# EasyEDA Pro project 4Layer_Artix7_DDR3_Core_Board.epro, schematic Schematic1
Board Name: Board1; Create Date: 2025-05-25; Page Name: P1; Project Name: Artix7_DDR_4Layer_Core; Schematic Name: Schematic1; Update Date: 2025-05-25; Company: 嘉立创EDA; Page Size: A4; Version: V1.0
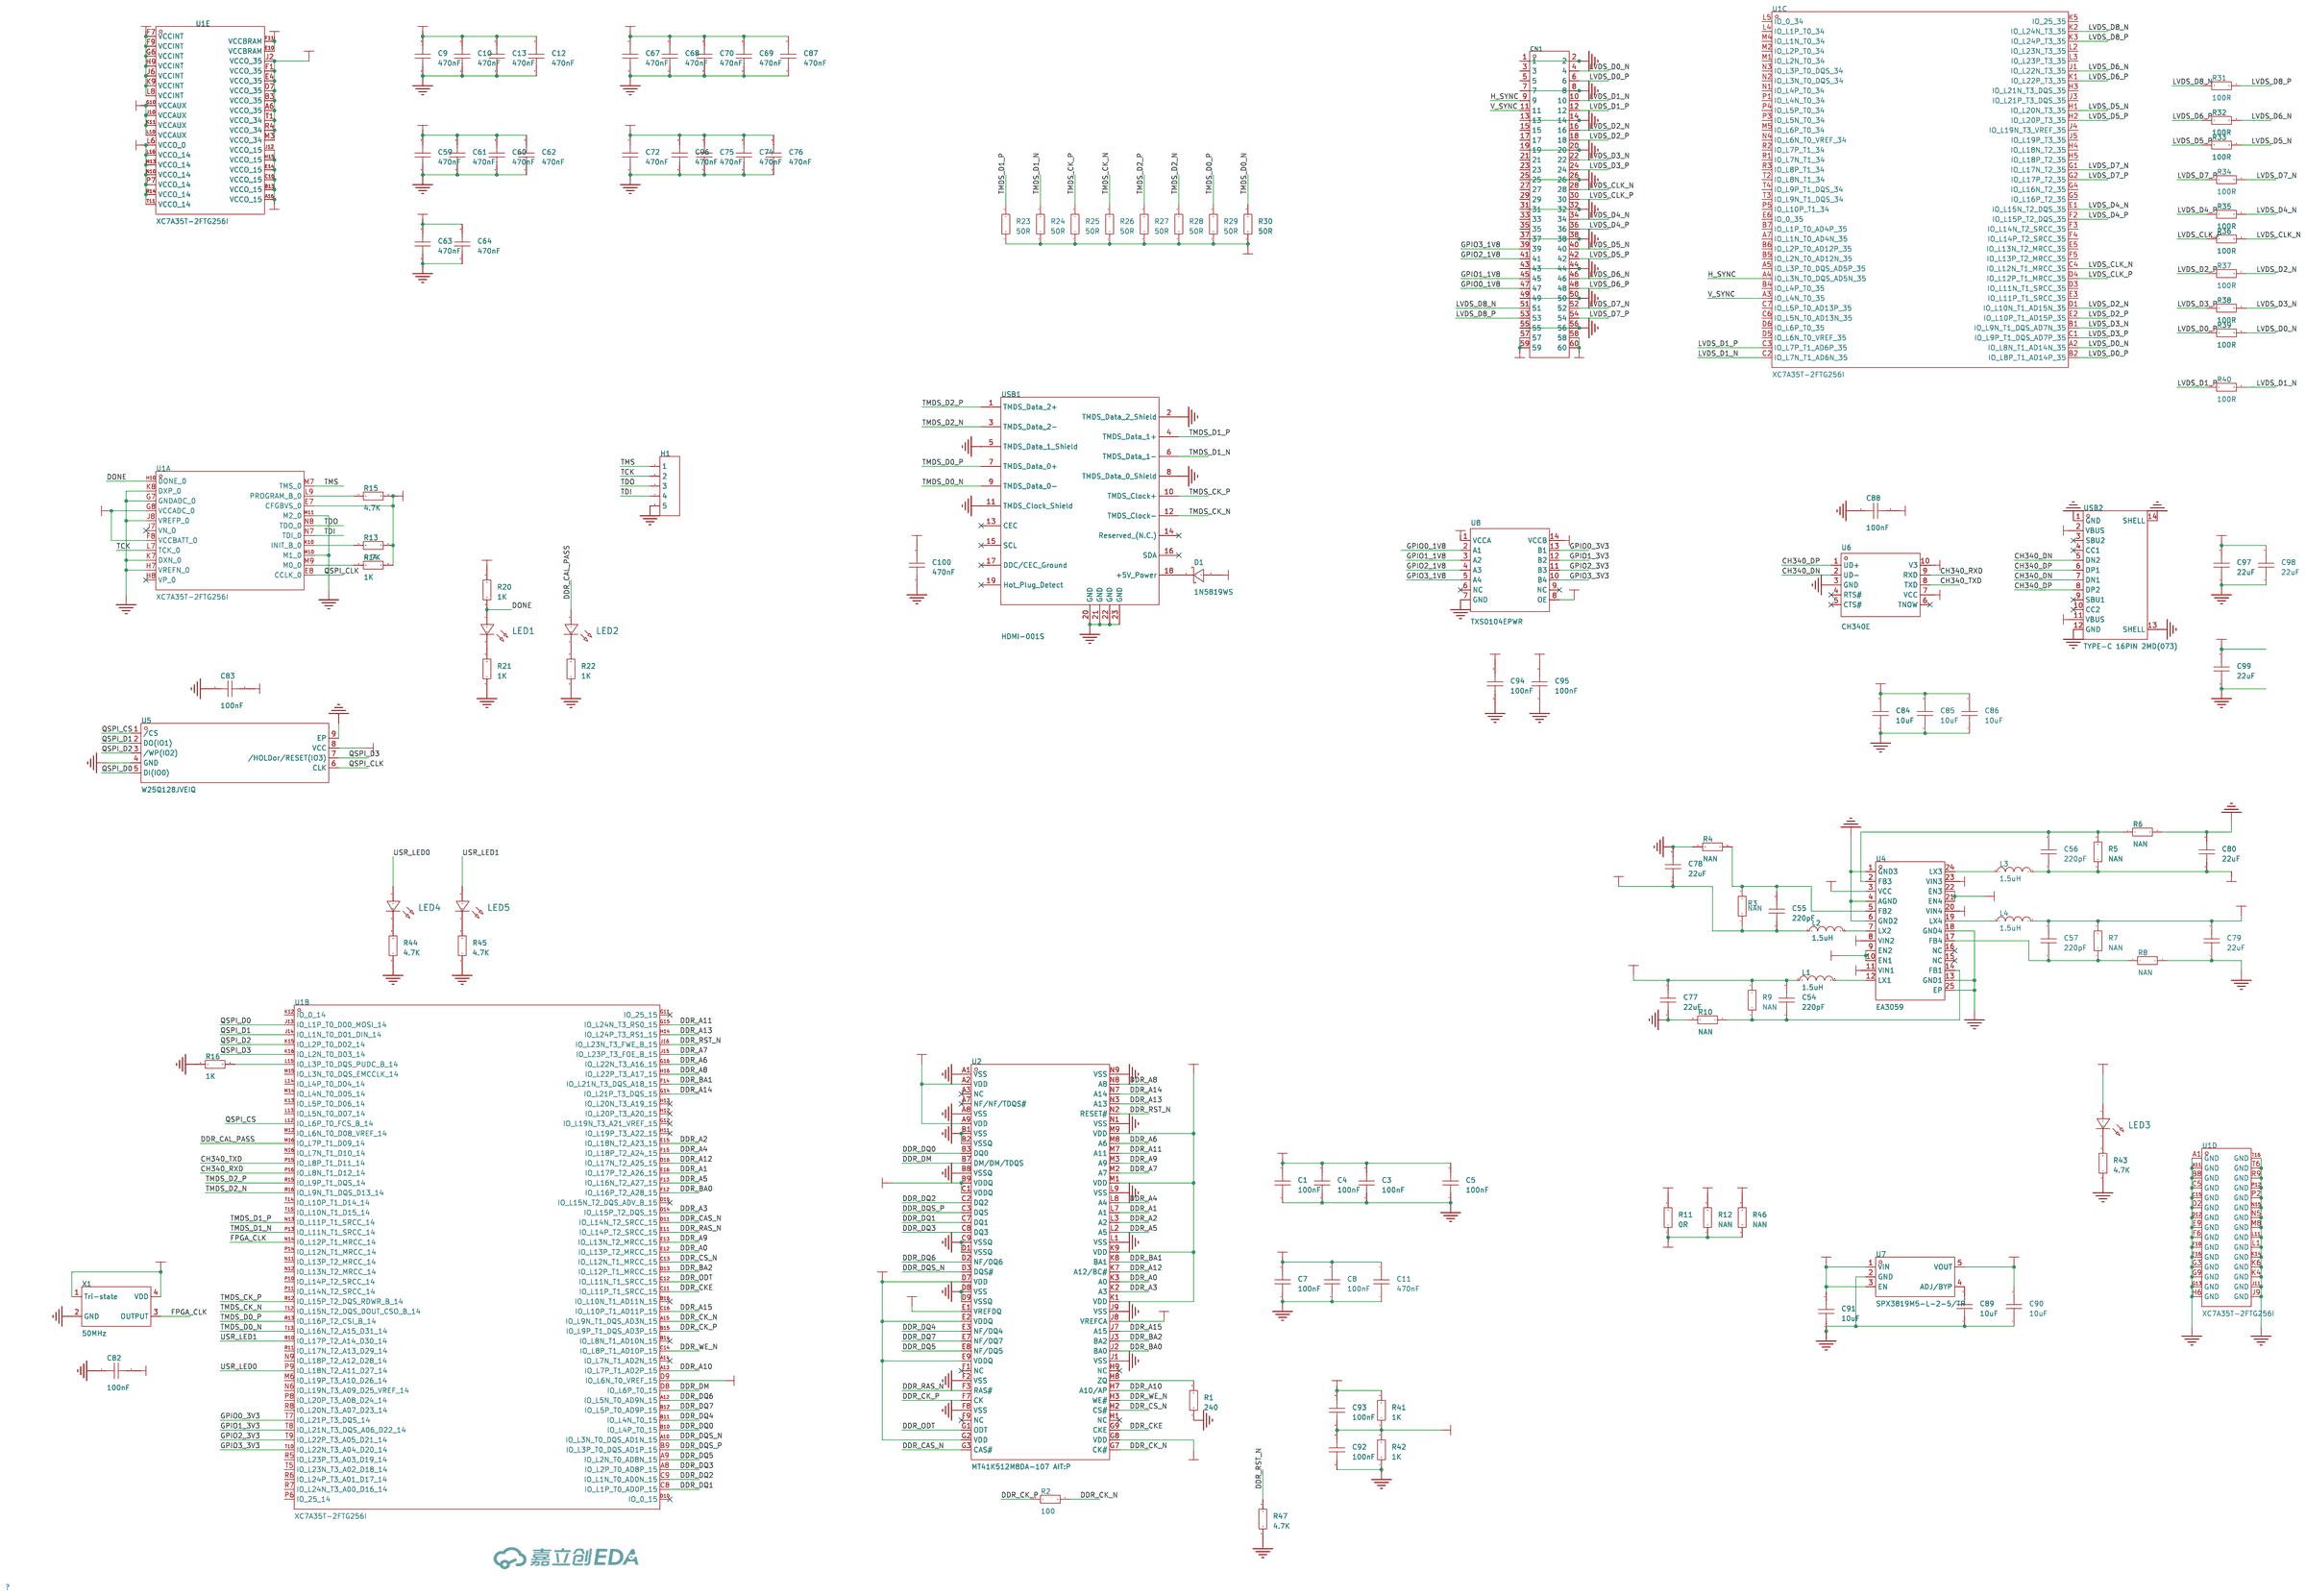
[diagram p0: schematic sheet]

## Parts
C1  100nF  [C0402]
C3  100nF  [C0402]
C4  100nF  [C0402]
C5  100nF  [C0402]
C7  100nF  [C0402]
C8  100nF  [C0402]
C9  470nF  [C0402-S]
C10  470nF  [C0402-S]
C11  470nF  [C0402-S]
C12  470nF  [C0402-S]
C13  470nF  [C0402-S]
C54  220pF  [C0603]
C55  220pF  [C0603]
C56  220pF  [C0603]
C57  220pF  [C0603]
C59  470nF  [C0402-S]
C60  470nF  [C0402-S]
C61  470nF  [C0402-S]
C62  470nF  [C0402-S]
C63  470nF  [C0402-S]
C64  470nF  [C0402-S]
C67  470nF  [C0402-S]
C68  470nF  [C0402-S]
C69  470nF  [C0402-S]
C70  470nF  [C0402-S]
C72  470nF  [C0402-S]
C74  470nF  [C0402-S]
C75  470nF  [C0402-S]
C76  470nF  [C0402-S]
C77  22uF  [C0805]
C78  22uF  [C0805]
C79  22uF  [C0805]
C80  22uF  [C0805]
C82  100nF  [C0603]
C83  100nF  [C0603]
C84  10uF  [C0603]
C85  10uF  [C0603]
C86  10uF  [C0603]
C87  470nF  [C0402-S]
C88  100nF  [C0603]
C89  10uF  [C0603]
C90  10uF  [C0603]
C91  10uF  [C0603]
C92  100nF  [C0603]
C93  100nF  [C0603]
C94  100nF  [C0603]
C95  100nF  [C0603]
C96  470nF  [C0402-S]
C97  22uF  [C0805]
C98  22uF  [C0805]
C99  22uF  [C0805]
C100  470nF  [C0402-S]
CN1  X0802WVS-60AS-LPV01  [CONN-SMD_60P-P0.80_XKB_X0802WVS-60ADS-LPV01]
D1  1N5819WS  [SOD-323_L1.8-W1.3-LS2.5-RD]
H1  -  [HDR-TH_5P-P2.54-V-F]
L1  1.5uH  [IND-SMD_L2.5-W2.0_YXMBL252010P]
L2  1.5uH  [IND-SMD_L2.5-W2.0_YXMBL252010P]
L3  1.5uH  [IND-SMD_L2.5-W2.0_YXMBL252010P]
L4  1.5uH  [IND-SMD_L2.5-W2.0_YXMBL252010P]
LED1  -  [LED_0603]
LED2  -  [LED_0603]
LED3  -  [LED_0603]
LED4  -  [LED_0603]
LED5  -  [LED_0603]
R1  240  [R0402]
R2  100  [R0402]
R3  NAN  [R0603]
R4  NAN  [R0603]
R5  NAN  [R0603]
R6  NAN  [R0603]
R7  NAN  [R0603]
R8  NAN  [R0603]
R9  NAN  [R0603]
R10  NAN  [R0603]
R11  0R  [R0603]
R12  NAN  [R0603]
R13  4.7K  [R0402]
R14  1K  [R0402]
R15  4.7K  [R0402]
R16  1K  [R0402]
R20  1K  [R0603]
R21  1K  [R0603]
R22  1K  [R0603]
R23  50R  [R0402]
R24  50R  [R0402]
R25  50R  [R0402]
R26  50R  [R0402]
R27  50R  [R0402]
R28  50R  [R0402]
R29  50R  [R0402]
R30  50R  [R0402]
R31  100R  [R0402]
R32  100R  [R0402]
R33  100R  [R0402]
R34  100R  [R0402]
R35  100R  [R0402]
R36  100R  [R0402]
R37  100R  [R0402]
R38  100R  [R0402]
R39  100R  [R0402]
R40  100R  [R0402]
R41  1K  [R0603]
R42  1K  [R0603]
R43  4.7K  [R0603]
R44  4.7K  [R0603]
R45  4.7K  [R0603]
R46  NAN  [R0603]
R47  4.7K  [R0402]
U1  XC7A35T-2FTG256I  [FTBGA-256_L17.0-W17.0-R16-C16-P1.00-TL]  (sections 1,2,3,4,5)
U2  MT41K512M8DA-107 AIT:P  [FBGA-78_L10.5-W8.0-R13-C6-P0.80-TL]
U4  EA3059  [VQFN-24_L4.0-W4.0-P0.50-TL-EP2.5]
U5  W25Q128JVEIQ  [WSON-8_L6.0-W8.0-P1.27-BL-EP]
U6  CH340E  [MSOP-10_L3.0-W3.0-P0.50-LS5.0-BL]
U7  SPX3819M5-L-2-5/TR  [SOT-23-5_L2.9-W1.6-P0.95-LS2.8-BR]
U8  TXS0104EPWR  [TSSOP-14_L5.0-W4.4-P0.65-LS6.4-BL]
USB1  HDMI-001S  [HDMI-SMD_HDMI-001S]
USB2  TYPE-C 16PIN 2MD(073)  [USB-C-SMD_TYPE-C-6PIN-2MD-073]
X1  50MHz  [OSC-SMD_4P-L3.2-W2.5-BL]

## Library data of the parts
C1 C3-C5 C7-C13 C59-C64 C67-C70 C72 C74-C76 C87 C96 C100 = CAP_0402: Supplier Footprint: 0402
C54-C57 = CL10B221KB8NNNC: 容值:220pF;精度:±10%;额定电压:50V;材质(温度系数):X7R;; LCSC Part Name: 220pF ±10% 50V; Supplier Part: C1603; Manufacturer: SAMSUNG(三星); Supplier Footprint: 0603; JLCPCB Part Class: Basic Part; Datasheet: https://atta.szlcsc.com/upload/public/pdf/source/20160218/1457707763339.pdf; Supplier: LCSC; Tolerance: ±10%; Voltage Rated: 50V; Temperature Coefficient: X7R
C77-C80 C97-C99 = CAP_0805: Supplier Footprint: 0805
C82-C86 C88-C95 = CAP_0603: Supplier Footprint: 0603
CN1 = X0802WVS-60AS-LPV01: PIN总数:60;间距:0.8mm;行数:2;公母:公;安装方式:立贴;额定电流:500mA;工作温度范围:-25℃~+85℃;; LCSC Part Name: PIN：60 间距0.8mm 公 立贴; Supplier Part: C2925331; Manufacturer: XKB Connectivity(中国星坤); Supplier Footprint: SMD,P=0.8mm; JLCPCB Part Class: 扩展库; Supplier: LCSC; Number of Pins: 60; Pitch: 0.8mm; Number of Rows: 2; Gender: 公; Mounting Style: 立贴; Current Rating (Max): 500mA; Operating Temperature Range: -25℃~+85℃
D1 = 1N5819WS_C191023: 正向压降(Vf):600mV@1A;直流反向耐压(Vr):40V;整流电流:1A;; LCSC Part Name: 电压:40V 电流:1A; Supplier Part: C191023; Manufacturer: Hottech(合科泰); Supplier Footprint: SOD-323; JLCPCB Part Class: 基础库; Datasheet: https://atta.szlcsc.com/upload/public/pdf/source/20220428/3CB86FD8D28D653594B4E35F9D5AEFD9.pdf; Supplier: LCSC; Forward Voltage (Vf@If): 600mV@1A; Reverse Voltage (Vr): 40V; Rectified Current: 1A
H1 = HDR-F_2.54_1x5P: Supplier Part: C50950; Supplier Footprint: 插件
L1-L4 = FWP252010P-1R5ML: 电感值:1.5uH;精度:±20%;额定电流:2.5A;类型:一体成型电感;饱和电流(Isat):2.6A;; LCSC Part Name: 1.5uH ±20% 2.6A; Supplier Part: C5179452; Manufacturer: cjiang(长江微电); Supplier Footprint: 1008; JLCPCB Part Class: Extended Part; Datasheet: https://atta.szlcsc.com/upload/public/pdf/source/20220919/6437779B41DFA72ADCBB2BAC61339FA9.pdf; Supplier: LCSC; Tolerance: ±20%; Rated Current: 2.5A; Type: 一体成型电感; DC Resistance (DCR): 76mΩ; Saturation Current (Isat): 2.6A
LED1-LED5 = LED_0603-R: Supplier Footprint: 0603
R1 R2 R13-R16 R23-R40 R47 = Res_0402: Supplier Footprint: 0402
R3-R12 R20-R22 R41-R46 = Res_0603: Supplier Footprint: 0603
U1 = XC7A35T-2FTG256I: LCSC Part Name: XC7A35T 2FTG256I -; Supplier Part: C1521744; Manufacturer: XILINX(赛灵思); Supplier Footprint: FTBGA-256; JLCPCB Part Class: Extended Part; Supplier: LCSC
U2 = MT41K512M8DA-107 AIT:P: 存储器构架(格式):SDRAM DDR3L;时钟频率(fc):-;存储容量:4Gbit;; Supplier Part: C1348756; Manufacturer: micron(镁光); Supplier Footprint: FBGA-78(8x10.5); JLCPCB Part Class: 扩展库; Datasheet: https://atta.szlcsc.com/upload/public/pdf/source/20210823/3BBDCC20C1D6BCF226EC39D08C0A3480.pdf; Supplier: LCSC; Memory Format: SDRAM DDR3L; Memory Size: 4Gbit; Voltage - Supply: 1.28V~1.45V; Current - Supply: 29mA; Refresh Current: 10mA; Operating Temperature: -40℃~+95℃
U4 = EA3059: 电源电压:2.7V~5.5V;最大充电电流:-;电池类型:-;电池节数:4;; Supplier Part: C111586; Manufacturer: everanalog(申风); Supplier Footprint: QFN-24-EP(4x4); JLCPCB Part Class: 扩展库; Supplier: LCSC; Supply Voltage: 2.7V~5.5V; Number of Cells: 4
U5 = W25Q128JVEIQ: 存储容量:128Mbit;; Supplier Part: C401662; Manufacturer: WINBOND(华邦); Supplier Footprint: WSON-8-EP(6x8); JLCPCB Part Class: 扩展库; Datasheet: https://atta.szlcsc.com/upload/public/pdf/source/20190705/C401662_06B6D416F67ED315879B366F63A3F7C9.pdf; Supplier: LCSC; Memory Size: 128Mbit
U6 = CH340E: 应用功能:收发器;接口协议:USB 2.0;数据速率:2Mbps;; LCSC Part Name: USB转串口芯片CH340; Supplier Part: C99652; Manufacturer: WCH(南京沁恒); Supplier Footprint: MSOP-10; JLCPCB Part Class: 扩展库; Datasheet: https://atta.szlcsc.com/upload/public/pdf/source/20240313/4FD4567B6A986AE079C4960D6CEBDDB5.pdf; Supplier: LCSC; Applications Function: 收发器; Protocol: USB 2.0; Supply Voltage: 3.3V；5V; Data Rate: 2Mbps
U7 = SPX3819M5-L-2-5/TR: 输出类型:固定;最大输入电压:16V;输出电压:2.5V;最大输出电流:500mA;输出极性:正极;; Supplier Part: C3028968; Manufacturer: MaxLinear(迈凌); Supplier Footprint: SOT-23-5; JLCPCB Part Class: 扩展库; Datasheet: https://atta.szlcsc.com/upload/public/pdf/source/20221008/2AABB09F5444A68502DBDDC280A262C8.pdf; Supplier: LCSC; Output Type: 固定; Maximum Input Voltage: 16V; Output Voltage: 2.5V; MAX Output Current: 500mA; Dropout Voltage: 700mV@(500mA); standby current: 8uA; Operating Temperature: -40℃~+125℃; Output Polarity: 正极; Number of Outputs: 1
U8 = TXS0104EPWR: 数据速率:24Mbps;工作电压(VCCA):1.65V~3.6V;工作电压(VCCB):2.3V~5.5V;通道数:1;每个电路通道数:4;; Supplier Part: C44955; Manufacturer: TI(德州仪器); Supplier Footprint: TSSOP-14; JLCPCB Part Class: Extended Part; Datasheet: https://www.ti.com/cn/lit/gpn/txs0104e; Supplier: LCSC; Channel Type: 双向; Data Rate: 24Mbps; Voltage - Supply(VCCA): 1.65V~3.6V; Voltage - Supply(VCCB): 2.3V~5.5V; Number of Circuits: 4; Output Type: 推挽式；开漏; Operating Temperature: -40℃~+85℃; Features: 自动方向检测
USB1 = HDMI-001S: 19PIN A型前插后贴HDMI插座 铜壳; Supplier Part: C720616; Manufacturer: XUNPU(讯普); Supplier Footprint: SMD; JLCPCB Part Class: 扩展库; Datasheet: https://atta.szlcsc.com/upload/public/pdf/source/20230810/ECFF1CC9EF38DC7E290ED6B9AC4EFC06.pdf; Supplier: LCSC; Connector Type: HDMI-A; Gender: 母; Number of Pins: 19P; Mounting Style: 卧贴
USB2 = TYPE-C 16PIN 2MD(073): 连接器类型:Type-C;标准:USB 3.1;公母:母;安装方式:卧贴;触点数量:16P;端口数量:1;额定电流 - 电源:5A;工作温度范围:-25℃~+85℃;; LCSC Part Name: Type-C 母 卧贴; Supplier Part: C2765186; Manufacturer: SHOU HAN(首韩); Supplier Footprint: SMD; JLCPCB Part Class: 扩展库; Datasheet: https://atta.szlcsc.com/upload/public/pdf/source/20211123/39B17C16241EAC15C5E277BDA434118E.pdf; Supplier: LCSC; Connector Type: Type-C; Standard: USB 3.1; Gender: 母; Mounting Style: 卧贴; Number of Contacts: 16P; Number of Ports: 1; Current Rating - Power (Max): 5A; Operating Temperature Range: -25℃~+85℃; Rated Voltage (Max): 5V; Connect-Disconnect Life: 5千次; Core Colour: 黑色
X1 = OT322550MJBA4SL: 频率:50MHz;常温频差:±10ppm;输出模式:CMOS;工作电压:1.8V~3.3V;频率稳定度:±20ppm;; LCSC Part Name: YSO110TR 50MHZ 4P 3225 1.8V-3.3V ±10PPM -40~85℃ (±20PPM) CMOS; Supplier Part: C717684; Manufacturer: YXC(扬兴晶振); Supplier Footprint: SMD3225-4P; JLCPCB Part Class: 扩展库; Datasheet: https://atta.szlcsc.com/upload/public/pdf/source/20240731/596E5F7673E50DA744B7F79F139FB8DF.pdf; Supplier: LCSC; Normal temperature Frequency Tolerance: ±10ppm; Output Type: CMOS; Voltage - Supply: 1.8V~3.3V; Frequency Stability: ±20ppm; Operating Temperature: -40℃~+85℃

## Nets
+1V0: C56.1 C59.2 C60.2 C61.2 C62.2 C80.1 L3.2 R5.1 U1.E10(VCCBRAM) U1.F7(VCCINT) U1.F9(VCCINT) U1.F11(VCCBRAM) U1.G6(VCCINT) U1.H9(VCCINT) U1.J6(VCCINT) U1.K9(VCCINT) U1.L8(VCCINT)
+1V5: C1.2 C3.2 C4.2 C5.2 C9.2 C10.2 C12.2 C13.2 C55.1 C78.1 C93.2 L2.1 R3.1 R41.2 U1.A16(VCCO_15) U1.B13(VCCO_15) U1.C10(VCCO_15) U1.E14(VCCO_15) U1.H15(VCCO_15) U1.J12(VCCO_15) U2.A2(VDD) U2.A9(VDD) U2.B9(VDDQ) U2.C1(VDDQ) U2.D7(VDD) U2.E2(VDDQ) U2.E9(VDDQ) U2.G2(VDD) U2.G8(VDD) U2.K1(VDD) U2.K9(VDD) U2.M1(VDD) U2.M9(VDD)
+1V8: C57.2 C63.2 C64.2 C79.2 C94.2 L4.2 R7.2 R11.2 U1.F8(VCCBATT_0) U1.G8(VCCADC_0) U1.G10(VCCAUX) U1.J10(VCCAUX) U1.K11(VCCAUX) U1.L10(VCCAUX) U8.1(VCCA) U8.8(OE)
+2V5: C90.2 R12.2 U7.5(VOUT)
+3V3: C54.2 C67.2 C68.2 C69.2 C70.2 C77.2 C82.2 C83.2 C87.2 C88.2 C95.2 C100.2 L1.1 LED3.2(A) R9.2 R13.2 R14.2 R15.2 R20.2 R23.1 R24.1 R25.1 R26.1 R27.1 R28.1 R29.1 R30.1 R46.2 U1.E7(CFGBVS_0) U1.L6(VCCO_0) U1.L16(VCCO_14) U1.M13(VCCO_14) U1.N10(VCCO_14) U1.P7(VCCO_14) U1.R14(VCCO_14) U1.T11(VCCO_14) U5.8(VCC) U6.7(VCC) U6.10(V3) U8.14(VCCB) X1.1(Tri-state) X1.4(VDD)
GND: C1.1 C3.1 C4.1 C5.1 C7.1 C8.1 C9.1 C10.1 C11.1 C12.1 C13.1 C59.1 C60.1 C61.1 C62.1 C63.1 C64.1 C67.1 C68.1 C69.1 C70.1 C72.1 C74.1 C75.1 C76.1 C77.1 C78.2 C79.1 C80.2 C82.1 C83.1 C84.1 C85.1 C86.1 C87.1 C88.1 C89.1 C90.1 C91.1 C92.1 C94.1 C95.1 C96.1 C97.1 C98.1 C99.1 C100.1 CN1.1 CN1.2 CN1.7 CN1.8 CN1.13 CN1.14 CN1.19 CN1.20 CN1.25 CN1.26 CN1.31 CN1.32 CN1.37 CN1.38 CN1.43 CN1.44 CN1.49 CN1.50 CN1.55 CN1.56 H1.5 R1.1 R4.1 R6.2 R8.2 R10.2 R16.1 R21.1 R22.1 R42.1 R43.1 R44.1 R45.1 R47.1 U1.A1(GND) U1.A11(GND) U1.B8(GND) U1.C5(GND) U1.C15(GND) U1.D2(GND) U1.D12(GND) U1.E9(GND) U1.F6(GND) U1.F10(GND) U1.F16(GND) U1.G3(GND) U1.G7(GNDADC_0) U1.G9(GND) U1.G13(GND) U1.H6(GND) U1.H7(VREFN_0) U1.J8(VREFP_0) U1.J9(GND) U1.J11(GND) U1.K4(GND) U1.K6(GND) U1.K7(DXN_0) U1.K8(DXP_0) U1.K14(GND) U1.L1(GND) U1.L11(GND) U1.M8(GND) U1.M10(M1_0) U1.M11(M2_0) U1.N5(GND) U1.N15(GND) U1.P2(GND) U1.P12(GND) U1.R9(GND) U1.T6(GND) U1.T16(GND) U2.A1(VSS) U2.A8(VSS) U2.B1(VSS) U2.B2(VSSQ) U2.B8(VSSQ) U2.C9(VSSQ) U2.D1(VSSQ) U2.D8(VSS) U2.D9(VSSQ) U2.F2(VSS) U2.F8(VSS) U2.J1(VSS) U2.J9(VSS) U2.L1(VSS) U2.L9(VSS) U2.N1(VSS) U2.N9(VSS) U4.1(GND3) U4.4(AGND) U4.6(GND2) U4.13(GND1) U4.18(GND4) U4.25(EP) U5.4(GND) U5.9(EP) U6.3(GND) U7.2(GND) U8.7(GND) USB1.2(TMDS Data 2 Shield) USB1.5(TMDS Data 1 Shield) USB1.8(TMDS Data 0 Shield) USB1.11(TMDS Clock Shield) USB1.20(GND) USB1.21(GND) USB1.22(GND) USB1.23(GND) USB2.1(GND) USB2.12(GND) USB2.13(SHELL) USB2.14(SHELL) X1.2(GND)
VCC: C84.2 C85.2 C86.2 C91.2 C97.2 C98.2 C99.2 CN1.57 CN1.58 CN1.59 CN1.60 D1.2(A) U4.3(VCC) U4.8(VIN2) U4.9(EN2) U4.10(EN1) U4.11(VIN1) U4.20(VIN4) U4.21(EN4) U4.22(EN3) U4.23(VIN3) U7.1(VIN) U7.3(EN) USB2.2(VBUS) USB2.11(VBUS)
VCCIO_34_35: C72.2 C74.2 C75.2 C76.2 C96.2 R11.1 R12.1 R46.1 U1.A6(VCCO_35) U1.B3(VCCO_35) U1.D7(VCCO_35) U1.E4(VCCO_35) U1.F1(VCCO_35) U1.J2(VCCO_35) U1.M3(VCCO_34) U1.R4(VCCO_34) U1.T1(VCCO_34)
CH340_DN: U6.2(UD-) USB2.5(DN2) USB2.7(DN1)
CH340_DP: U6.1(UD+) USB2.6(DP1) USB2.8(DP2)
CH340_RXD: U1.P16(IO_L8N_T1_D12_14) U6.9(RXD)
CH340_TXD: U1.P15(IO_L8P_T1_D11_14) U6.8(TXD)
DDR_A0: U1.E12(IO_L13P_T2_MRCC_15) U2.K3(A0)
DDR_A1: U1.E16(IO_L17P_T2_A26_15) U2.L7(A1)
DDR_A2: U1.E15(IO_L18N_T2_A23_15) U2.L3(A2)
DDR_A3: U1.D14(IO_L15P_T2_DQS_15) U2.K2(A3)
DDR_A4: U1.F15(IO_L18P_T2_A24_15) U2.L8(A4)
DDR_A5: U1.F13(IO_L16N_T2_A27_15) U2.L2(A5)
DDR_A6: U1.G16(IO_L22N_T3_A16_15) U2.M8(A6)
DDR_A7: U1.J15(IO_L23P_T3_FOE_B_15) U2.M2(A7)
DDR_A8: U1.H16(IO_L22P_T3_A17_15) U2.N8(A8)
DDR_A9: U1.E13(IO_L13N_T2_MRCC_15) U2.M3(A9)
DDR_A10: U1.A13(IO_L7P_T1_AD2P_15) U2.H7(A10/AP)
DDR_A11: U1.G15(IO_L24N_T3_RS0_15) U2.M7(A11)
DDR_A12: U1.D16(IO_L17N_T2_A25_15) U2.K7(A12/BC#)
DDR_A13: U1.H14(IO_L24P_T3_RS1_15) U2.N3(A13)
DDR_A14: U1.G14(IO_L21P_T3_DQS_15) U2.N7(A14)
DDR_A15: U1.C16(IO_L10P_T1_AD11P_15) U2.J7(A15)
DDR_BA0: U1.F12(IO_L16P_T2_A28_15) U2.J2(BA0)
DDR_BA1: U1.F14(IO_L21N_T3_DQS_A18_15) U2.K8(BA1)
DDR_BA2: U1.D13(IO_L12P_T1_MRCC_15) U2.J3(BA2)
DDR_CAL_PASS: LED2.2(A) U1.M16(IO_L7P_T1_D09_14)
DDR_CAS_N: U1.D11(IO_L14N_T2_SRCC_15) U2.G3(CAS#)
DDR_CK_N: R2.2 U1.A15(IO_L9N_T1_DQS_AD3N_15) U2.G7(CK#)
DDR_CK_P: R2.1 U1.B15(IO_L9P_T1_DQS_AD3P_15) U2.F7(CK)
DDR_CKE: U1.C11(IO_L11P_T1_SRCC_15) U2.G9(CKE)
DDR_CS_N: U1.C13(IO_L12N_T1_MRCC_15) U2.H2(CS#)
DDR_DM: U1.D8(IO_L6P_T0_15) U2.B7(DM/DM/TDQS)
DDR_DQ0: U1.B10(IO_L4P_T0_15) U2.B3(DQ0)
DDR_DQ1: U1.C8(IO_L1P_T0_AD0P_15) U2.C7(DQ1)
DDR_DQ2: U1.C9(IO_L1N_T0_AD0N_15) U2.C2(DQ2)
DDR_DQ3: U1.A8(IO_L2P_T0_AD8P_15) U2.C8(DQ3)
DDR_DQ4: U1.B11(IO_L4N_T0_15) U2.E3(NF/DQ4)
DDR_DQ5: U1.A9(IO_L2N_T0_AD8N_15) U2.E8(NF/DQ5)
DDR_DQ6: U1.A12(IO_L5N_T0_AD9N_15) U2.D2(NF/DQ6)
DDR_DQ7: U1.B12(IO_L5P_T0_AD9P_15) U2.E7(NF/DQ7)
DDR_DQS_N: U1.A10(IO_L3N_T0_DQS_AD1N_15) U2.D3(DQS#)
DDR_DQS_P: U1.B9(IO_L3P_T0_DQS_AD1P_15) U2.C3(DQS)
DDR_ODT: U1.C12(IO_L11N_T1_SRCC_15) U2.G1(ODT)
DDR_RAS_N: U1.E11(IO_L14P_T2_SRCC_15) U2.F3(RAS#)
DDR_RST_N: R47.2 U1.J16(IO_L23N_T3_FWE_B_15) U2.N2(RESET#)
DDR_VREF: C7.2 C8.2 C11.2 C92.2 C93.1 R41.1 R42.2 U1.D9(IO_L6N_T0_VREF_15) U2.E1(VREFDQ) U2.J8(VREFCA)
DDR_WE_N: U1.C14(IO_L8P_T1_AD10P_15) U2.H3(WE#)
DONE: LED1.2(A) R20.1 U1.H10(DONE_0)
FPGA_CLK: U1.N14(IO_L12P_T1_MRCC_14) X1.3(OUTPUT)
GPIO0_1V8: CN1.47 U8.2(A1)
GPIO0_3V3: U1.T7(IO_L21P_T3_DQS_14) U8.13(B1)
GPIO1_1V8: CN1.45 U8.3(A2)
GPIO1_3V3: U1.T8(IO_L21N_T3_DQS_A06_D22_14) U8.12(B2)
GPIO2_1V8: CN1.41 U8.4(A3)
GPIO2_3V3: U1.T9(IO_L22P_T3_A05_D21_14) U8.11(B3)
GPIO3_1V8: CN1.39 U8.5(A4)
GPIO3_3V3: U1.T10(IO_L22N_T3_A04_D20_14) U8.10(B4)
H_SYNC: CN1.9 U1.A4(IO_L3N_T0_DQS_AD5N_35)
LVDS_CLK_N: CN1.28 R36.2 U1.C4(IO_L12N_T1_MRCC_35)
LVDS_CLK_P: CN1.30 R36.1 U1.D4(IO_L12P_T1_MRCC_35)
LVDS_D0_N: CN1.4 R39.2 U1.A2(IO_L8N_T1_AD14N_35)
LVDS_D0_P: CN1.6 R39.1 U1.B2(IO_L8P_T1_AD14P_35)
LVDS_D1_N: CN1.10 R40.2 U1.C2(IO_L7N_T1_AD6N_35)
LVDS_D1_P: CN1.12 R40.1 U1.C3(IO_L7P_T1_AD6P_35)
LVDS_D2_N: CN1.16 R37.2 U1.D1(IO_L10N_T1_AD15N_35)
LVDS_D2_P: CN1.18 R37.1 U1.E2(IO_L10P_T1_AD15P_35)
LVDS_D3_N: CN1.22 R38.2 U1.B1(IO_L9N_T1_DQS_AD7N_35)
LVDS_D3_P: CN1.24 R38.1 U1.C1(IO_L9P_T1_DQS_AD7P_35)
LVDS_D4_N: CN1.34 R35.2 U1.E1(IO_L15N_T2_DQS_35)
LVDS_D4_P: CN1.36 R35.1 U1.F2(IO_L15P_T2_DQS_35)
LVDS_D5_N: CN1.40 R33.2 U1.H1(IO_L20N_T3_35)
LVDS_D5_P: CN1.42 R33.1 U1.H2(IO_L20P_T3_35)
LVDS_D6_N: CN1.46 R32.2 U1.J1(IO_L22N_T3_35)
LVDS_D6_P: CN1.48 R32.1 U1.K1(IO_L22P_T3_35)
LVDS_D7_N: CN1.52 R34.2 U1.G1(IO_L17N_T2_35)
LVDS_D7_P: CN1.54 R34.1 U1.G2(IO_L17P_T2_35)
LVDS_D8_N: CN1.51 R31.1 U1.K2(IO_L24N_T3_35)
LVDS_D8_P: CN1.53 R31.2 U1.K3(IO_L24P_T3_35)
QSPI_CLK: U1.E8(CCLK_0) U5.6(CLK)
QSPI_CS: U1.L12(IO_L6P_T0_FCS_B_14) U5.1(/CS)
QSPI_D0: U1.J13(IO_L1P_T0_D00_MOSI_14) U5.5(DI(IO0))
QSPI_D1: U1.J14(IO_L1N_T0_D01_DIN_14) U5.2(DO(IO1))
QSPI_D2: U1.K15(IO_L2P_T0_D02_14) U5.3(/WP(IO2))
QSPI_D3: U1.K16(IO_L2N_T0_D03_14) U5.7(/HOLDor/RESET(IO3))
TCK: H1.2 U1.L7(TCK_0)
TDI: H1.4 U1.N7(TDI_0)
TDO: H1.3 U1.N8(TDO_0)
TMDS_CK_N: R26.2 U1.T12(IO_L15N_T2_DQS_DOUT_CSO_B_14) USB1.12(TMDS Clock-)
TMDS_CK_P: R25.2 U1.R12(IO_L15P_T2_DQS_RDWR_B_14) USB1.10(TMDS Clock+)
TMDS_D0_N: R30.2 U1.T13(IO_L16N_T2_A15_D31_14) USB1.9(TMDS Data 0-)
TMDS_D0_P: R29.2 U1.R13(IO_L16P_T2_CSI_B_14) USB1.7(TMDS Data 0+)
TMDS_D1_N: R24.2 U1.P13(IO_L11N_T1_SRCC_14) USB1.6(TMDS Data 1-)
TMDS_D1_P: R23.2 U1.N13(IO_L11P_T1_SRCC_14) USB1.4(TMDS Data 1+)
TMDS_D2_N: R28.2 U1.R16(IO_L9N_T1_DQS_D13_14) USB1.3(TMDS Data 2-)
TMDS_D2_P: R27.2 U1.R15(IO_L9P_T1_DQS_14) USB1.1(TMDS Data 2+)
TMS: H1.1 U1.M7(TMS_0)
USR_LED0: LED4.2(A) U1.P9(IO_L18N_T2_A11_D27_14)
USR_LED1: LED5.2(A) U1.R10(IO_L17P_T2_A14_D30_14)
V_SYNC: CN1.11 U1.A3(IO_L4N_T0_35)
$1N3209: R1.2 U2.H8(ZQ)
$1N5677: L3.1 U4.24(LX3)
$1N5678: L4.1 U4.19(LX4)
$1N5681: L1.2 U4.12(LX1)
$1N5684: C54.1 R9.1 R10.1 U4.14(FB1)
$1N5685: C57.1 R7.1 R8.1 U4.17(FB4)
$1N5688: C56.2 R5.2 R6.1 U4.2(FB3)
$1N5689: C55.2 R3.2 R4.2 U4.5(FB2)
$1N5696: L2.2 U4.7(LX2)
$1N7035: R13.1 U1.K10(INIT_B_0)
$1N7039: R14.1 U1.M9(M0_0)
$1N7068: R15.1 U1.L9(PROGRAM_B_0)
$1N7365: R16.2 U1.L15(IO_L3P_T0_DQS_PUDC_B_14)
$1N8205: LED1.1(C) R21.2
$1N8234: LED2.1(C) R22.2
$1N11413: D1.1(K) USB1.18(+5V Power)
$1N11901: C89.2 U7.4(ADJ/BYP)
$1N13705: LED3.1(C) R43.2
$1N13948: LED4.1(C) R44.2
$1N14026: LED5.1(C) R45.2

Not connected (* = marked no-connect by the designer): CN1 3 5 15 17 21 23 27 29 33 35; U1 A5(IO_L3P_T0_DQS_AD5P_35) A7(IO_L1N_T0_AD4N_35) A14(IO_L7N_T1_AD2N_15)* B4(IO_L4P_T0_35) B5(IO_L2N_T0_AD12N_35) B6(IO_L2P_T0_AD12P_35) B7(IO_L1P_T0_AD4P_35) B14(IO_L8N_T1_AD10N_15)* B16(IO_L10N_T1_AD11N_15)* C6(IO_L5N_T0_AD13N_35) C7(IO_L5P_T0_AD13P_35) D3(IO_L11N_T1_SRCC_35) D5(IO_L6N_T0_VREF_35) D6(IO_L6P_T0_35) D10(IO_0_15)* D15(IO_L15N_T2_DQS_ADV_B_15)* E3(IO_L11P_T1_SRCC_35) E5(IO_L13N_T2_MRCC_35) E6(IO_0_35) F3(IO_L14N_T2_SRCC_35) F4(IO_L14P_T2_SRCC_35) F5(IO_L13P_T2_MRCC_35) G4(IO_L16N_T2_35) G5(IO_L16P_T2_35) G11(IO_25_15)* G12(IO_L19N_T3_A21_VREF_15)* H3(IO_L21N_T3_DQS_35) H4(IO_L18N_T2_35) H5(IO_L18P_T2_35) H8(VP_0)* H11(IO_L19P_T3_A22_15)* H12(IO_L20P_T3_A20_15)* H13(IO_L20N_T3_A19_15)* J3(IO_L21P_T3_DQS_35) J4(IO_L19N_T3_VREF_35) J5(IO_L19P_T3_35) J7(VN_0)* K5(IO_25_35) K12(IO_0_14) K13(IO_L5P_T0_D06_14) L2(IO_L23N_T3_35) L3(IO_L23P_T3_35) L4(IO_L1P_T0_34) L5(IO_0_34) L13(IO_L5N_T0_D07_14) L14(IO_L4P_T0_D04_14) M1(IO_L2N_T0_34) M2(IO_L2P_T0_34) M4(IO_L1N_T0_34) M5(IO_L6P_T0_34) M6(IO_L19P_T3_A10_D26_14) M12(IO_L6N_T0_D08_VREF_14) M14(IO_L4N_T0_D05_14) M15(IO_L3N_T0_DQS_EMCCLK_14) N1(IO_L4P_T0_34) N2(IO_L3N_T0_DQS_34) N3(IO_L3P_T0_DQS_34) N4(IO_L6N_T0_VREF_34) N6(IO_L19N_T3_A09_D25_VREF_14) N9(IO_L18P_T2_A12_D28_14) N11(IO_L13P_T2_MRCC_14) N12(IO_L13N_T2_MRCC_14) N16(IO_L7N_T1_D10_14) P1(IO_L4N_T0_34) P3(IO_L5N_T0_34) P4(IO_L5P_T0_34) P5(IO_L10P_T1_34) P6(IO_25_14) P8(IO_L20P_T3_A08_D24_14) P10(IO_L14P_T2_SRCC_14) P11(IO_L14N_T2_SRCC_14) P14(IO_L12N_T1_MRCC_14) R1(IO_L7N_T1_34) R2(IO_L7P_T1_34) R3(IO_L8P_T1_34) R5(IO_L23P_T3_A03_D19_14) R6(IO_L24P_T3_A01_D17_14) R7(IO_L24N_T3_A00_D16_14) R8(IO_L20N_T3_A07_D23_14) R11(IO_L17N_T2_A13_D29_14) T2(IO_L8N_T1_34) T3(IO_L9N_T1_DQS_34) T4(IO_L9P_T1_DQS_34) T5(IO_L23N_T3_A02_D18_14) T14(IO_L10P_T1_D14_14) T15(IO_L10N_T1_D15_14); U2 A3(NC)* A7(NF/NF/TDQS#)* F1(NC)* F9(NC)* H1(NC)* H9(NC)*; U4 15(NC)* 16(NC)*; U6 4(RTS#)* 5(CTS#)* 6(TNOW)*; U8 6(NC)* 9(NC)*; USB1 13(CEC)* 14(Reserved (N.C.))* 15(SCL)* 16(SDA)* 17(DDC/CEC Ground)* 19(Hot Plug Detect)*; USB2 3(SBU2)* 4(CC1)* 9(SBU1)* 10(CC2)*
